# Altium schematic sheet LED_Driver - 2.SchDoc
size A3
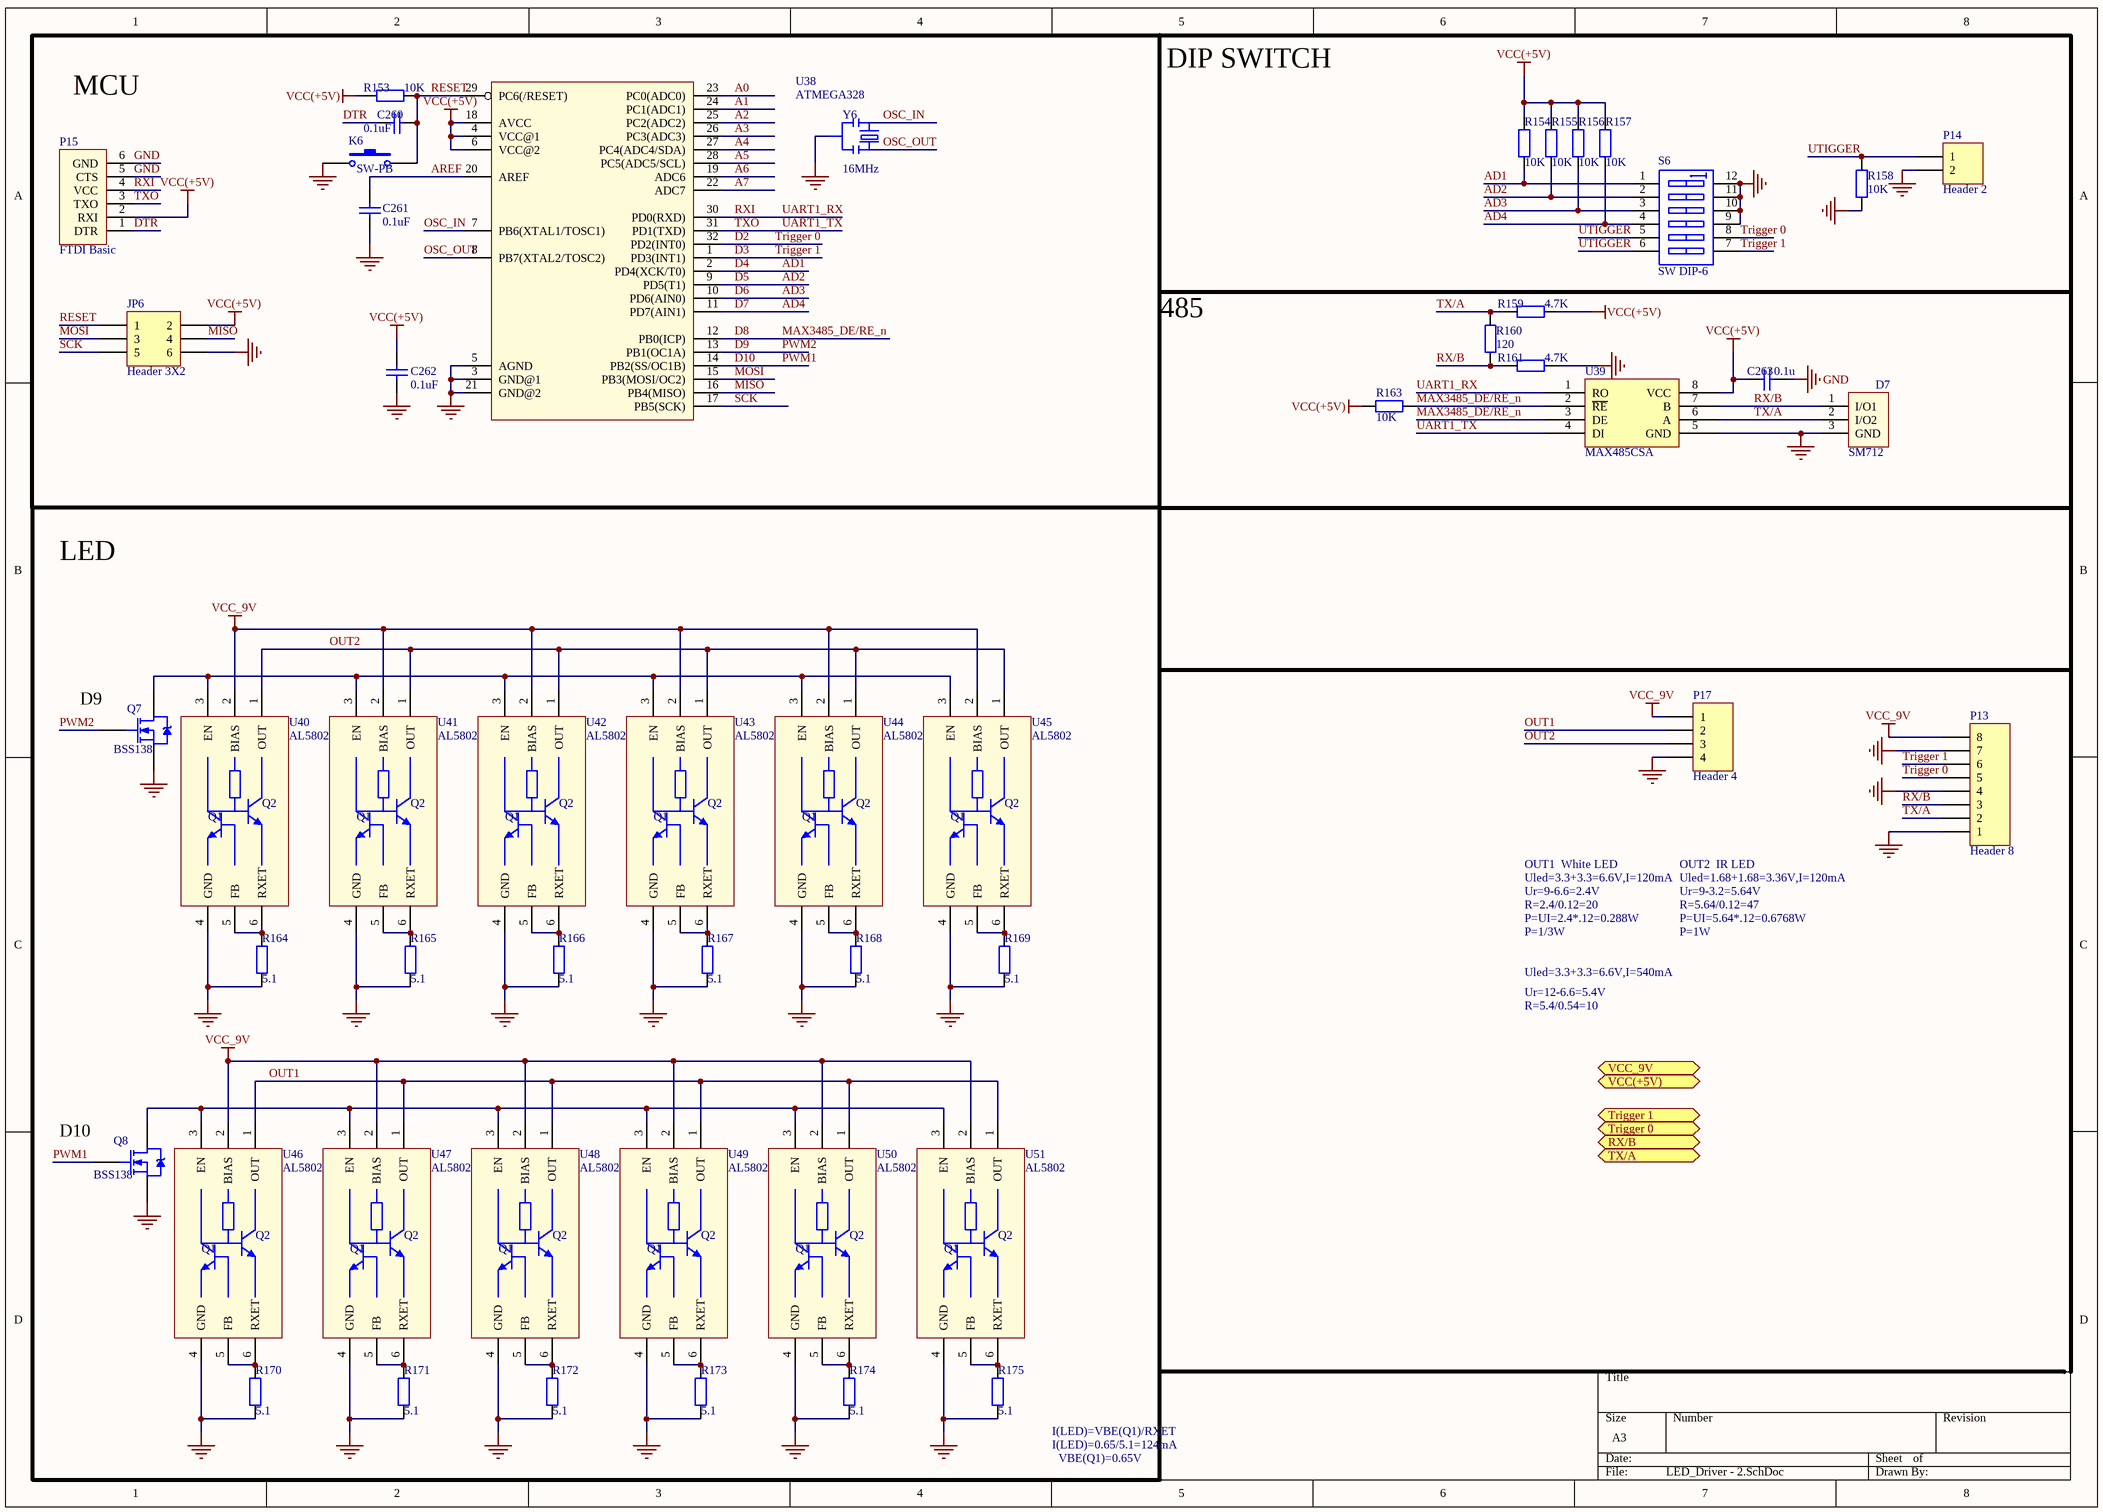
[diagram p0: LED_Driver - 2.SchDoc]

## Parts
C260  0.1uF  [C0603]
C261  0.1uF  [C0603]
C262  0.1uF  [C0603]
C263  0.1u  [C0603]
D7  SM712  [SOT23-3]
JP6  Header 3X2  [MHDR1X6]
K6  SW-PB  [157SW]
P13  Header 8  [SH_1.25MM*8]
P14  Header 2  [HDR1X2]
P15  FTDI Basic  [MHDR1X6]
P17  Header 4  [SMT_1.25MM*4]
Q7  BSS138  [SOT-23 (Standard)]
Q8  BSS138  [SOT-23 (Standard)]
R153  10K  [R0603]
R154  10K  [R0603]
R155  10K  [R0603]
R156  10K  [R0603]
R157  10K  [R0603]
R158  10K  [R0603]
R159  4.7K  [R0603]
R160  120  [R0603]
R161  4.7K  [R0603]
R163  10K  [R0603]
R164  5.1  [R0603]
R165  5.1  [R0603]
R166  5.1  [R0603]
R167  5.1  [R0603]
R168  5.1  [R0603]
R169  5.1  [R0603]
R170  5.1  [R0603]
R171  5.1  [R0603]
R172  5.1  [R0603]
R173  5.1  [R0603]
R174  5.1  [R0603]
R175  5.1  [R0603]
S6  SW DIP-6  [DIP_SW_6WAY_SMD]
U38  ATMEGA328  [TQFP32-08]
U39  MAX485CSA  [SOIC-8]
U40  AL5802  [SOT26]
U41  AL5802  [SOT26]
U42  AL5802  [SOT26]
U43  AL5802  [SOT26]
U44  AL5802  [SOT26]
U45  AL5802  [SOT26]
U46  AL5802  [SOT26]
U47  AL5802  [SOT26]
U48  AL5802  [SOT26]
U49  AL5802  [SOT26]
U50  AL5802  [SOT26]
U51  AL5802  [SOT26]
Y6  16MHz  [RESONATOR-SMD]

## Blocks framed on the sheet
LED: Q7 Q8 R164-R175 U40-U51

## Ports
RX/B (bidir), Trigger 0 (bidir), Trigger 1 (bidir), TX/A (bidir), VCC(+5V) (in), VCC_9V (bidir)

## Nets
GND: C261.1 C262.2 C263.1 D7.3(GND) JP6.6 K6.1 P13.1 P13.4 P13.7 P14.2 P15.5(CTS) P15.6(GND) P17.4 Q7.S Q8.S R158.1 R161.1 R164.2 R165.2 R166.2 R167.2 R168.2 R169.2 R170.2 R171.2 R172.2 R173.2 R174.2 R175.2 S6.9(B4) S6.10(B3) S6.11(B2) S6.12(B1) U38.3(GND@1) U38.5(AGND) U38.21(GND@2) U39.5(GND) U40.4(GND) U41.4(GND) U42.4(GND) U43.4(GND) U44.4(GND) U45.4(GND) U46.4(GND) U47.4(GND) U48.4(GND) U49.4(GND) U50.4(GND) U51.4(GND) Y6.2
VCC(+5V): C262.1 C263.2 JP6.2 P15.2(RXI) R153.1 R154.1 R155.1 R156.1 R157.1 R159.1 R163.2 U38.4(VCC@1) U38.6(VCC@2) U38.18(AVCC) U39.8(VCC)
VCC_9V: P13.8 P17.1 U40.2(BIAS) U41.2(BIAS) U42.2(BIAS) U43.2(BIAS) U44.2(BIAS) U45.2(BIAS) U46.2(BIAS) U47.2(BIAS) U48.2(BIAS) U49.2(BIAS) U50.2(BIAS) U51.2(BIAS)
A0: U38.23(PC0(ADC0))
A1: U38.24(PC1(ADC1))
A2: U38.25(PC2(ADC2))
A3: U38.26(PC3(ADC3))
A4: U38.27(PC4(ADC4/SDA))
A5: U38.28(PC5(ADC5/SCL))
A6: U38.19(ADC6)
A7: U38.22(ADC7)
AD1: R154.2 S6.1(A1) U38.2(PD4(XCK/T0))  [also labelled D4]
AD2: R155.2 S6.2(A2) U38.9(PD5(T1))  [also labelled D5]
AD3: R156.2 S6.3(A3) U38.10(PD6(AIN0))  [also labelled D6]
AD4: R157.2 S6.4(A4) U38.11(PD7(AIN1))  [also labelled D7]
AREF: C261.2 U38.20(AREF)
D2: P13.5 S6.8(B5) U38.32(PD2(INT0))  [also labelled Trigger 0]
D3: P13.6 S6.7(B6) U38.1(PD3(INT1))  [also labelled Trigger 1]
D8: R163.1 U38.12(PB0(ICP)) U39.2(~{RE}) U39.3(DE)  [also labelled MAX3485_DE/RE_n]
D9: Q7.G U38.13(PB1(OC1A))  [also labelled PWM2]
D10: Q8.G U38.14(PB2(SS/OC1B))  [also labelled PWM1]
DTR: C260.1 P15.1(DTR)
MISO: JP6.4 U38.16(PB4(MISO))
MOSI: JP6.3 U38.15(PB3(MOSI/OC2))
OSC_IN: U38.7(PB6(XTAL1/TOSC1)) Y6.3
OSC_OUT: U38.8(PB7(XTAL2/TOSC2)) Y6.1
OUT1: P17.2 U46.1(OUT) U47.1(OUT) U48.1(OUT) U49.1(OUT) U50.1(OUT) U51.1(OUT)
OUT2: P17.3 U40.1(OUT) U41.1(OUT) U42.1(OUT) U43.1(OUT) U44.1(OUT) U45.1(OUT)
RESET: C260.2 JP6.1 K6.2 R153.2 U38.29(PC6(/RESET))
RX/B: D7.1(I/O1) P13.3 R160.2 R161.2 U39.7(B)
RXI: P15.4(VCC) U38.30(PD0(RXD)) U39.1(RO)  [also labelled UART1_RX]
SCK: JP6.5 U38.17(PB5(SCK))
TX/A: D7.2(I/O2) P13.2 R159.2 R160.1 U39.6(A)
TXO: P15.3(TXO) U38.31(PD1(TXD)) U39.4(DI)  [also labelled UART1_TX]
UTIGGER: P14.1 R158.2 S6.5(A5) S6.6(A6)
NetQ7_D: Q7.D U40.3(EN) U41.3(EN) U42.3(EN) U43.3(EN) U44.3(EN) U45.3(EN)
NetQ8_D: Q8.D U46.3(EN) U47.3(EN) U48.3(EN) U49.3(EN) U50.3(EN) U51.3(EN)
NetR164_1: R164.1 U40.5(FB) U40.6(RXET)
NetR165_1: R165.1 U41.5(FB) U41.6(RXET)
NetR166_1: R166.1 U42.5(FB) U42.6(RXET)
NetR167_1: R167.1 U43.5(FB) U43.6(RXET)
NetR168_1: R168.1 U44.5(FB) U44.6(RXET)
NetR169_1: R169.1 U45.5(FB) U45.6(RXET)
NetR170_1: R170.1 U46.5(FB) U46.6(RXET)
NetR171_1: R171.1 U47.5(FB) U47.6(RXET)
NetR172_1: R172.1 U48.5(FB) U48.6(RXET)
NetR173_1: R173.1 U49.5(FB) U49.6(RXET)
NetR174_1: R174.1 U50.5(FB) U50.6(RXET)
NetR175_1: R175.1 U51.5(FB) U51.6(RXET)

## Notes on the sheet
- MCU
- DIP SWITCH
- 485
- (near Q7) D9
- Uled=3.3+3.3=6.6V,I=120mA
- OUT1  White LED
- R=2.4/0.12=20
- P=UI=2.4*.12=0.288W
- Ur=9-6.6=2.4V
- Uled=1.68+1.68=3.36V,I=120mA
- OUT2  IR LED
- R=5.64/0.12=47
- P=UI=5.64*.12=0.6768W
- Ur=9-3.2=5.64V
- P=1/3W
- Uled=3.3+3.3=6.6V,I=540mA
- Ur=12-6.6=5.4V
- P=1W
- R=5.4/0.54=10
- (near Q8) D10
- I(LED)=VBE(Q1)/RXET
- I(LED)=0.65/5.1=124mA
- VBE(Q1)=0.65V
- (in symbol AL5802) Q2; Q1

## Library data of the parts
C260-C262 = CAP SMT C100nF25V10%X7R: Capacitor; Voltage: 25V; iPartNumber: C100nF25V10%X7R; Value: 0.1uF
C263 = Cap: Capacitor; Value: 100pF; Published: 8-Jun-2000; LatestRevisionDate: 17-Jul-2002; LatestRevisionNote: Re-released for DXP Platform.; PackageReference: RAD-0.3; Publisher: Altium Limited
JP6 = Header 3X2: Header, 3-Pin, Dual row; LatestRevisionDate: 17-Jul-2002; LatestRevisionNote: Re-released for DXP Platform.; Publisher: Altium Limited
K6 = SW-PB: Switch; Published: 24-Mar-1999; LatestRevisionDate: 17-Jul-2002; LatestRevisionNote: Re-released for DXP Platform.; PackageReference: SPST-2; Publisher: Altium Limited; PackageDescription: Switch; 2 Leads
P13 = Header 8: Header, 8-Pin; LatestRevisionDate: 17-Jul-2002; LatestRevisionNote: Re-released for DXP Platform.; Publisher: Altium Limited
P14 = Header 2: Header, 2-Pin; LatestRevisionDate: 17-Jul-2002; LatestRevisionNote: Re-released for DXP Platform.; Publisher: Altium Limited
P15 = ARDUINO_SERIAL_PROGRAMPTH
P17 = Header 4: Header, 4-Pin; LatestRevisionDate: 17-Jul-2002; LatestRevisionNote: Re-released for DXP Platform.; Publisher: Altium Limited
Q7 Q8 = NMOS: Manufacturer: Fairchild Semiconductor; Manufacturer Part Number: BSS123; FET Type: MOSFET N-Channel, Metal Oxide; FET Feature: Logic Level Gate; Drain to Source Voltage (Vdss): 100V; Current - Continuous Drain (Id) @ 25°C: 170mA (Ta); Rds On (Max) @ Id, Vgs: 6 Ohm @ 170mA, 10V; Vgs(th) (Max) @ Id: 2V @ 1mA; Gate Charge (Qg) @ Vgs: 2.5nC @ 10V; Input Capacitance (Ciss) @ Vds: 73pF @ 25V; Power - Max: 360mW; Supplier 1: Digi-Key; Supplier Part Number 1: BSS123NCT-ND; RoHS: RoHS Compliant; Category: Discrete Semiconductor Products; Stock 1: 163946; Pricing 1: 1=0.24, 10=0.216, 25=0.1556, 100=0.1211, 250=0.07612, 500=0.06484, 1000=0.04418 (USD); Packaging: Cut Tape (CT); Mounting Type: Surface Mount; Package / Case: TO-236-3, SC-59, SOT-23-3; Supplier Device Package: SOT-23; ComponentLink1URL: http://www.fairchildsemi.com/datasheets/BS/BSS123.pdf; ComponentLink1Description: http://www.fairchildsemi.com/datasheets/BS/BSS123.pdf
R153-R157 R159-R161 R163-R175 = Res2: Resistor
R158 = Res2: Resistor; Value: 1k; Published: 8-Jun-2000; LatestRevisionDate: 17-Jul-2002; LatestRevisionNote: Re-released for DXP Platform.; PackageReference: AXIAL-0.4; Publisher: Altium Limited
S6 = SW DIP-6: DIP Switch, 6 Position, SPST; Published: 24-Mar-1999; LatestRevisionDate: 17-Jul-2002; LatestRevisionNote: Re-released for DXP Platform.; PackageReference: DIP-12/SW; Publisher: Altium Limited
U38 = ATMEGA168
U39 = MAX3485CSA
Y6 = RESONATORSMD